# EAGLE design wifinfo_esp01 (EAGLE 8.4.1)
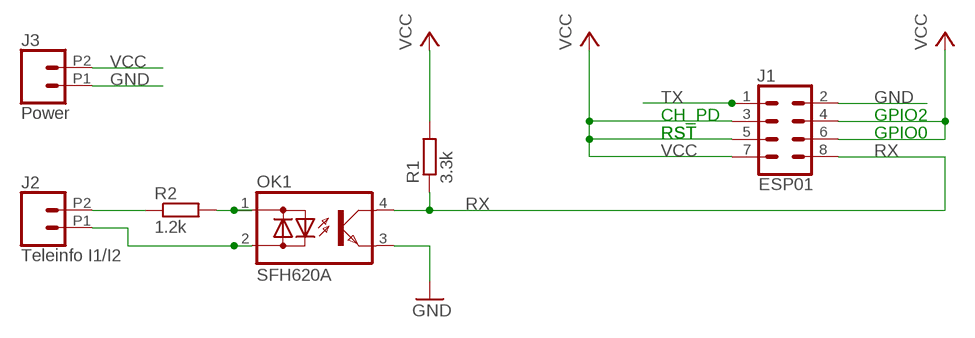
[diagram p0: schematic, sheet 1]

## Parts
J1  ESP01  CONN_04X2  [2X4]
J2  Teleinfo I1/I2  CONN_022.54MM_SCREWTERM  [1X02_2.54_SCREWTERM]
J3  Power  CONN_022.54MM_SCREWTERM  [1X02_2.54_SCREWTERM]
OK1  SFH620A  [DIL04]
R1  3.3k  R-EU_0204/7  [0204/7]
R2  1.2k  R-EU_0204/7  [0204/7]

## Nets
GND: J1.2 J3.P1 OK1.3(E)
N$2: OK1.1(AC1) R2.2
N$3: J2.P1 OK1.2(AC2)
N$4: J2.P2 R2.1
RX: J1.8 OK1.4(C) R1.1
TX: J1.1
VCC: J1.3 J1.4 J1.5 J1.6 J1.7 J3.P2 R1.2

## Notes on the sheet
- CH_PD | GPIO2
- RST | RST | GPIO0

## Library data of the parts
J1 = SparkFun-Connectors:CONN_04X2: Multi connection point. Often used as Generic Header-pin footprint for 0.1 inch spaced/style header connections On any of the 0.1 inch spaced packages, you can populate with these: Break Away Headers - Straight <https://www.sparkfun.com/products/116> (PRT-00116) Break Away Male Headers - Right Angle <https://www.sparkfun.com/products/553> (PRT-00553) Female Headers <https://www.sparkfun.com/products/115> (PRT-00115) Break Away Headers - Machine Pin <https://www.sparkfun.com/products/117> (PRT-00117) Break Away Female Headers - Swiss Machine Pin <https://www.sparkfun.com/products/743> (PRT-00743)
J2 J3 = SparkFun-Connectors:CONN_02: Multi connection point. Often used as Generic Header-pin footprint for 0.1 inch spaced/style header connections On any of the 0.1 inch spaced packages, you can populate with these: Break Away Headers - Straight <https://www.sparkfun.com/products/116> (PRT-00116) Break Away Male Headers - Right Angle <https://www.sparkfun.com/products/553> (PRT-00553) Female Headers <https://www.sparkfun.com/products/115> (PRT-00115) Break Away Headers - Machine Pin <https://www.sparkfun.com/products/117> (PRT-00117) Break Away Female Headers - Swiss Machine Pin <https://www.sparkfun.com/products/743> (PRT-00743) For SCREWTERMINALS and SPRING TERMINALS visit here: Screw Terimnals on SparkFun.com <https://www.sparkfun.com/search/results?term=Screw+Terminals> (5mm/3.5mm/2.54mm spacing) This device is also useful as a general connection point to wire up your design to another part of your project. Our various solder wires solder well into these plated through hole pads. Hook-Up Wire - Assortment (Stranded, 22 AWG) <https://www.sparkfun.com/products/11375> (PRT-11375) Hook-Up Wire - Assortment (Solid Core, 22 AWG) <https://www.sparkfun.com/products/11367> (PRT-11367) View the entire wire category on our website here <https://www.sparkfun.com/categories/141> Special notes: Molex polarized connector foot print use with: PRT-08233 with associated crimp pins and housings. 2.54_SCREWTERM for use with PRT-10571. 3.5mm Screw Terminal footprints for PRT-08084 5mm Screw Terminal footprints for use with PRT-08432
OK1 = optocoupler:SFH620: Optocoupler, Phototransistor Output, AC Input Source: http://www.vishay.com/docs/83675/sfh620.pdf; MPN: SFH620A-2; OC_FARNELL: 1469594; OC_NEWARK: 97K9546
R1 R2 = resistor:R-EU_: RESISTOR, European symbol

## Board
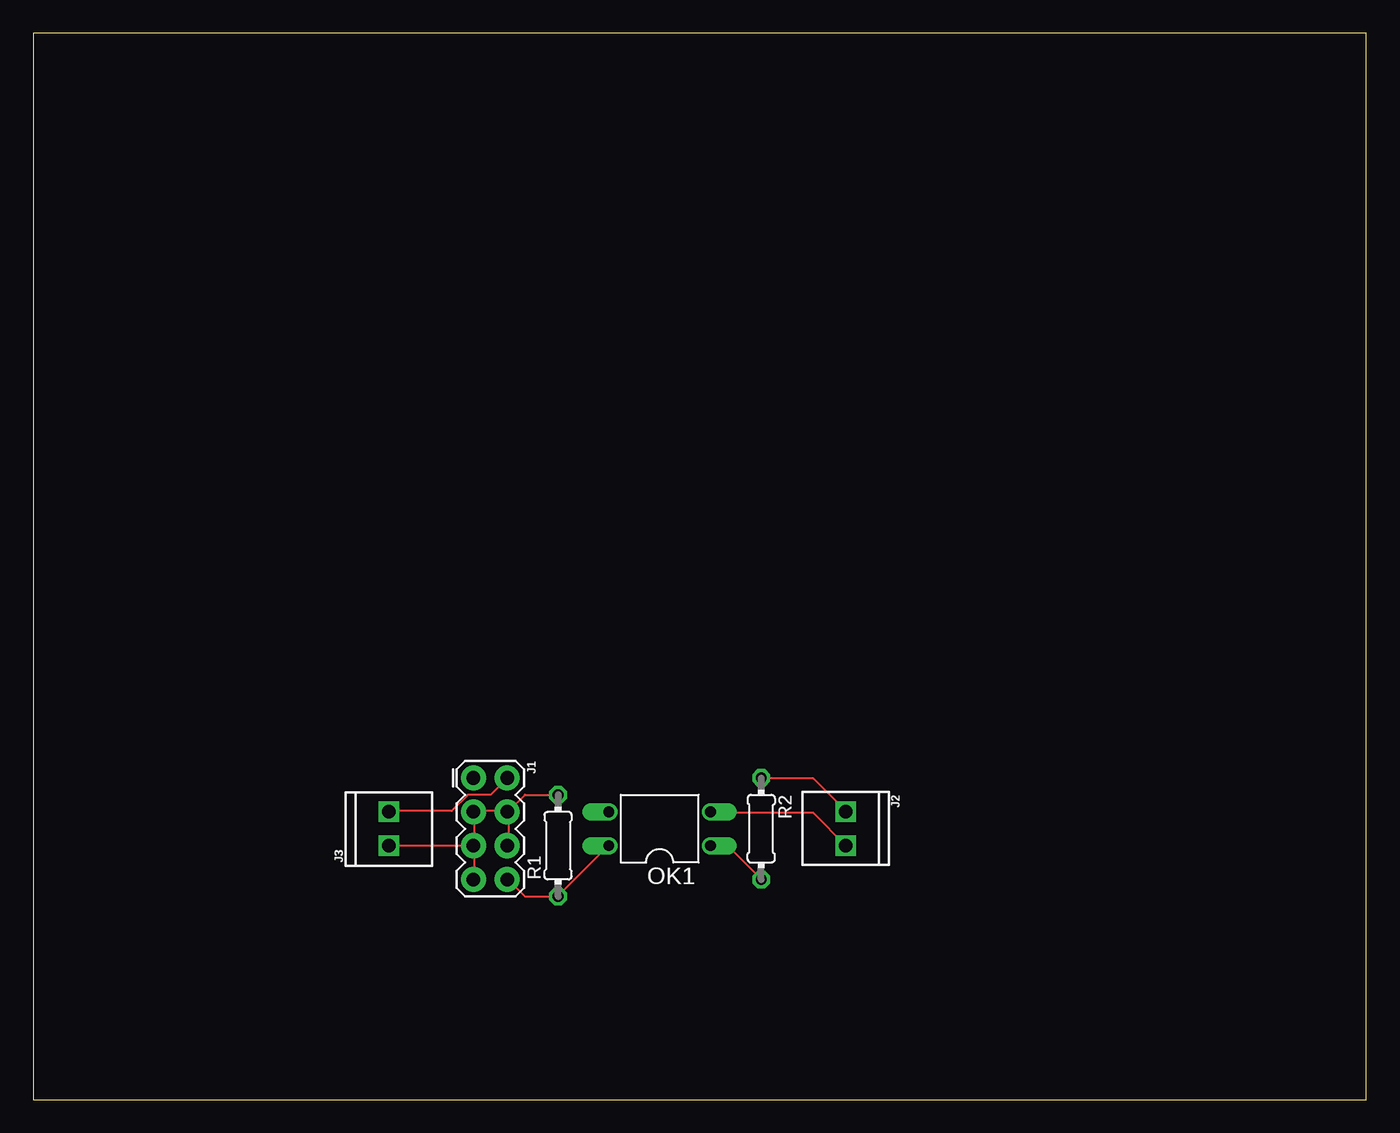
[diagram p1: board, top side]
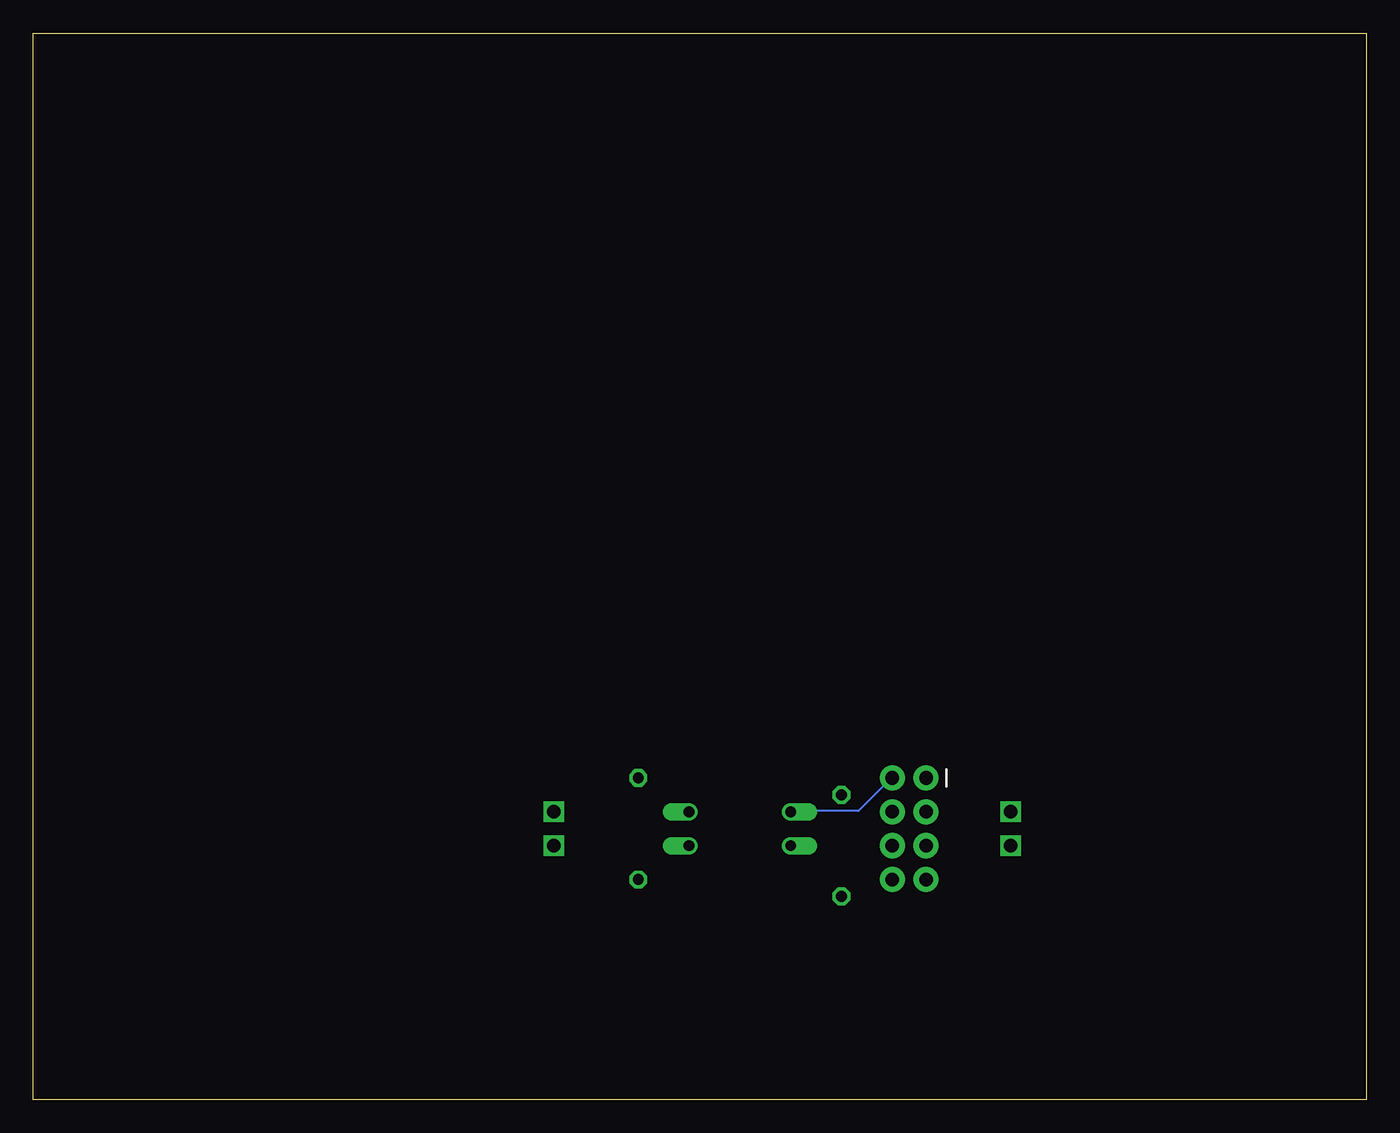
[diagram p2: board, bottom side, seen from below]

Size 100 x 80 mm. Coordinates in mm from the lower left corner, seen from the top.
Outline: 0,0 100,0 100,80 0,80 0,0
Copper layers (1*16): Top 0.035mm / dielectric 1.5mm / Bottom 0.035mm
Design rules "default": minimum track width 6mil, minimum drill 0.35mm, track to track 6mil, track to pad 6mil, pad to pad 6mil, via to via 6mil, smd to smd 6mil, copper to edge 40mil, drill to drill 6mil, minimum pad ring 10mil, minimum via ring 8mil, stop-mask expansion 4mil, vias tented up to drill 0mil, thermal gap 10mil

### Footprints (pad centres in the part's own frame; a part is rotated, then mirrored left to right if it is on the bottom)
2X4 = drill 1.016 pad 1.88: 1 -3.81,-1.27; 2 -3.81,1.27; 3 -1.27,-1.27; 4 -1.27,1.27; 5 1.27,-1.27; 6 1.27,1.27; 7 3.81,-1.27; 8 3.81,1.27
1X02_2.54_SCREWTERM = drill 1.016 square: P1 2.54,0; P2 0,0
DIL04 = drill 0.813 offset: 1 -1.27,-3.81; 2 1.27,-3.81; 3 1.27,3.81; 4 -1.27,3.81
0204/7 = drill 0.813 octagon: 1 -3.81,0; 2 3.81,0

### Placement (x,y rotation side)
J1  34.29,20.32 270 top
J2  60.96,21.59 270 top
J3  26.67,19.05 90 top
OK1  46.99,20.32 90 top
R1  39.37,19.05 90 top
R2  54.61,20.32 270 top

### Tracks (layer width: path | path; a pad name or v marks a point on that pad's centre or on a via)
GND
  Top 0.152: J1.2 34.29,22.86 32.61,22.86 31.39,21.64 26.67,21.64 J3.P1
  Bottom 0.152: OK1.3 43.13,21.64 38.1,21.64 35.66,24.08 J1.2
N$2
  Top 0.152: OK1.1 52.12,19.05 54.56,16.61 R2.2
N$3
  Top 0.152: J2.P1 58.52,21.49 50.9,21.49 OK1.2
N$4
  Top 0.152: R2.1 54.71,24.08 58.52,24.08 60.96,21.64 J2.P2
RX
  Top 0.152: 39.32,15.24 36.88,15.24 35.66,16.46 J1.8 | 39.32,15.24 43.13,19.05 OK1.4 | 39.32,15.24 R1.1
VCC
  Top 0.152: J3.P2 J1.5 33.07,19.05 | 33.07,19.05 33.07,16.61 J1.7 | R1.2 36.88,22.86 35.66,21.64 J1.4 | J1.6 35.66,19.05 35.66,21.49 J1.4 | J1.4 35.51,21.64 33.07,21.64 J1.3 33.07,21.49 33.07,19.05

### Text on the board
_tNames: J1 | R2 | J2 | J3 | R1 | OK1